# Altium project System 24 UPU.PrjPcb (part 2 of 3)

## Sheet Power.SchDoc
size C; SheetNumber: 2; SheetTotal: 4
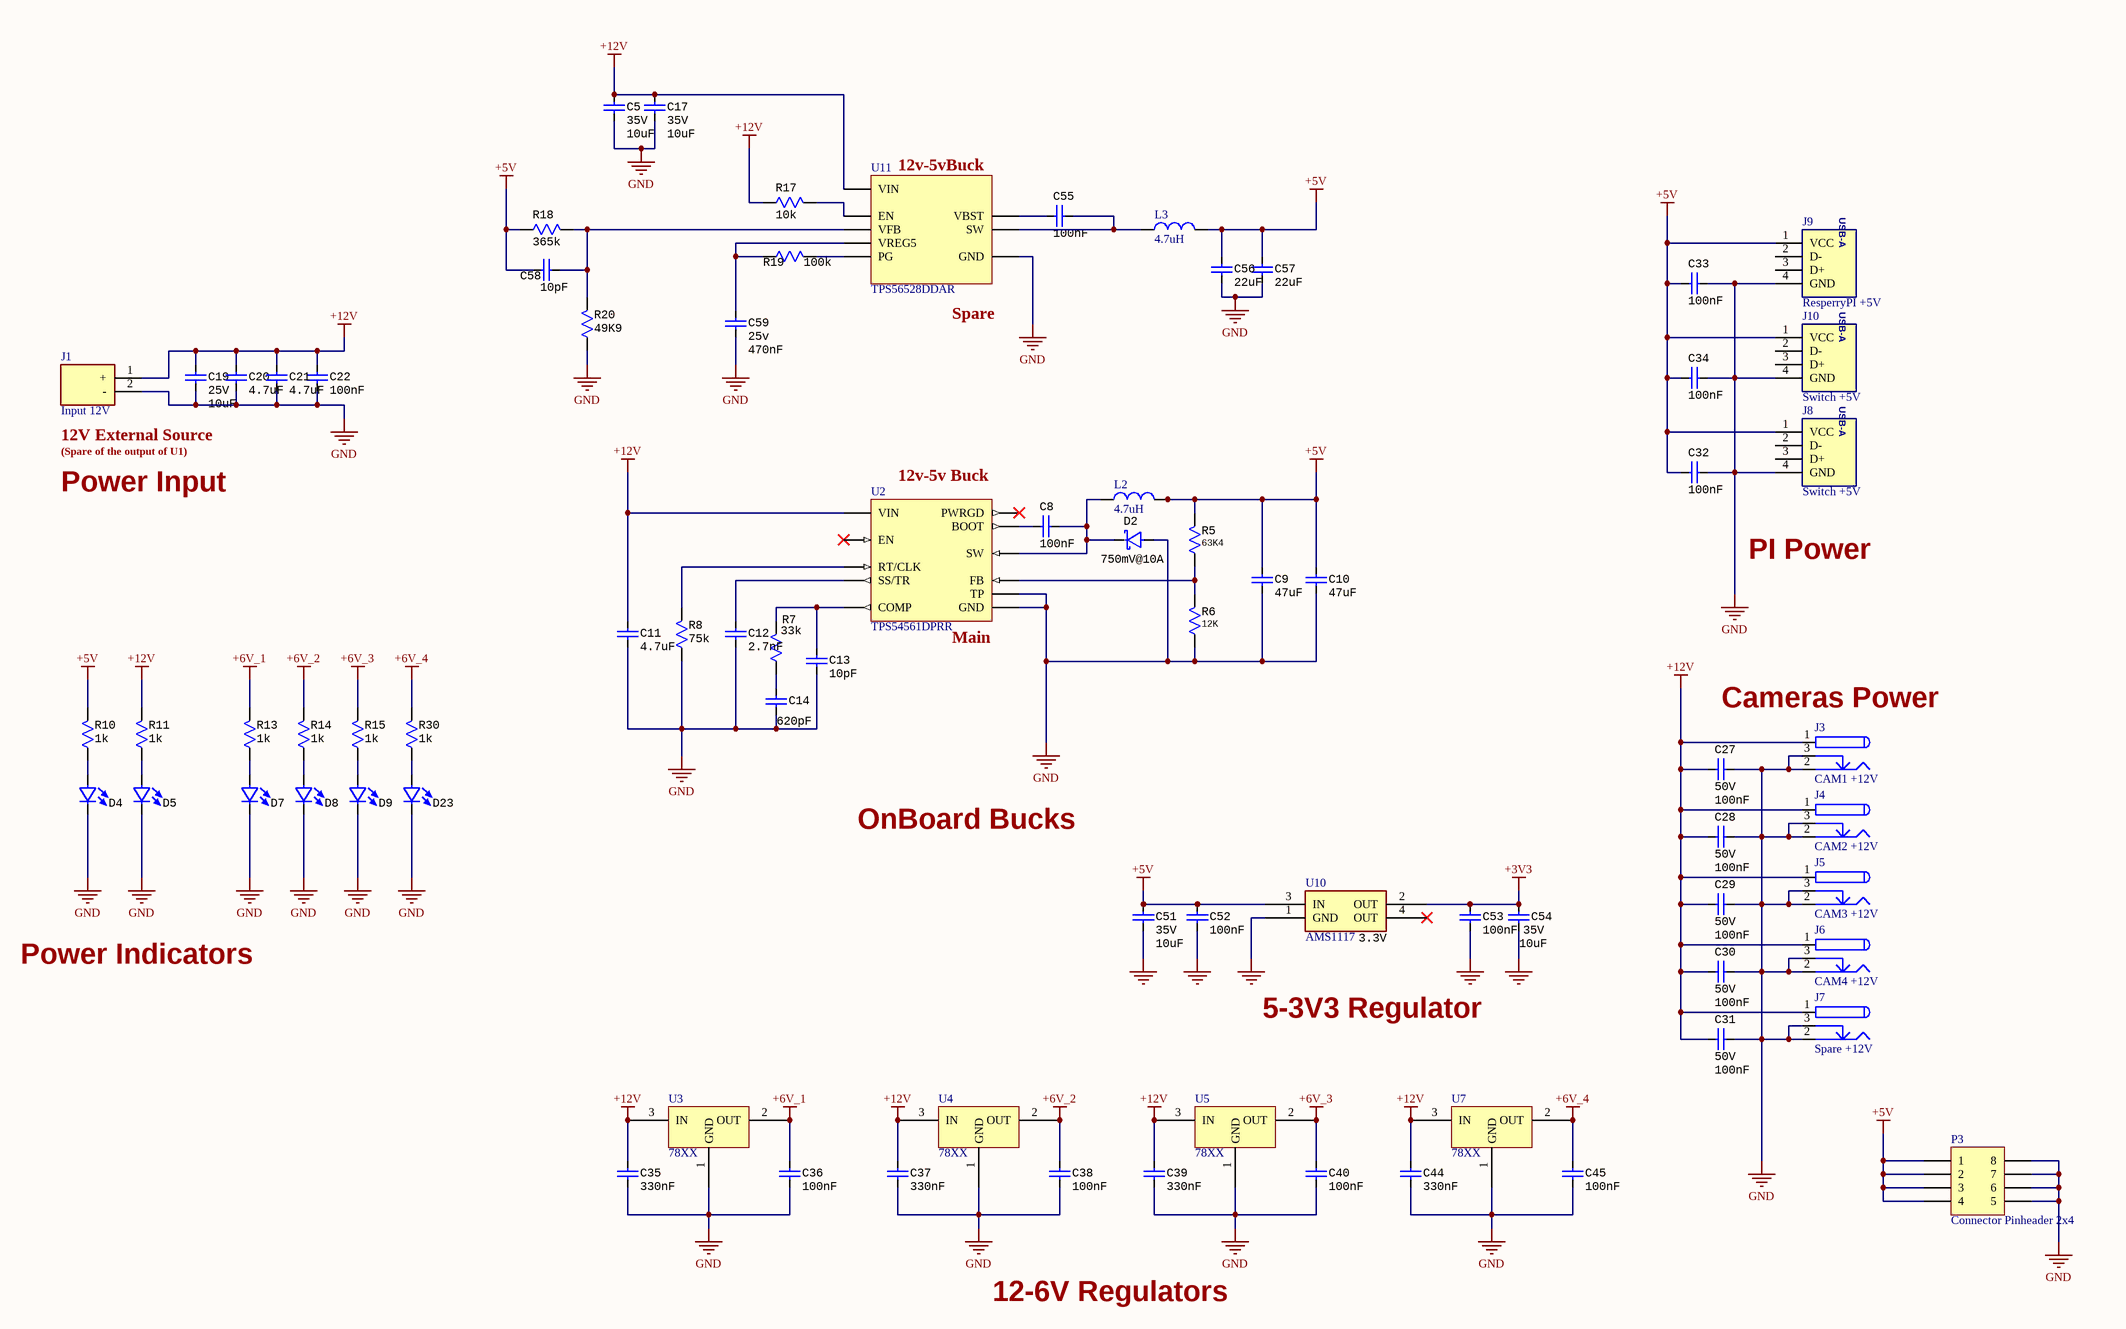
[diagram p1: Power.SchDoc]

### Parts
C5  Voltage: 35V  [CAP Ceramic SMD 0603]  (hidden comment: 10uF)
C8  100nF  [CAP Ceramic SMD 0603]
C9  47uF  [CAP Ceramic SMD 1206]
C10  47uF  [CAP Ceramic SMD 1206]
C11  4.7uF  [CAP Ceramic SMD 1206]
C12  2.7nF  [CAP Ceramic SMD 0603]
C13  10pF  [CAP Ceramic SMD 0603]
C14  620pF  [CAP Ceramic SMD 0603]
C17  Voltage: 35V  [CAP Ceramic SMD 0603]  (hidden comment: 10uF)
C19  Voltage: 25V  [CAP Ceramic SMD 1206]  (hidden comment: 10uF)
C20  4.7uF  [CAP Ceramic SMD 1206]
C21  4.7uF  [CAP Ceramic SMD 1206]
C22  100nF  [CAP Ceramic SMD 0603]
C27  Voltage: 50V  [CAP Ceramic SMD 0603]  (hidden comment: 100nF)
C28  Voltage: 50V  [CAP Ceramic SMD 0603]  (hidden comment: 100nF)
C29  Voltage: 50V  [CAP Ceramic SMD 0603]  (hidden comment: 100nF)
C30  Voltage: 50V  [CAP Ceramic SMD 0603]  (hidden comment: 100nF)
C31  Voltage: 50V  [CAP Ceramic SMD 0603]  (hidden comment: 100nF)
C32  100nF  [CAP Ceramic SMD 0603]
C33  100nF  [CAP Ceramic SMD 0603]
C34  100nF  [CAP Ceramic SMD 0603]
C35  330nF  [CAP Ceramic SMD 0603]
C36  100nF  [CAP Ceramic SMD 0603]
C37  330nF  [CAP Ceramic SMD 0603]
C38  100nF  [CAP Ceramic SMD 0603]
C39  330nF  [CAP Ceramic SMD 0603]
C40  100nF  [CAP Ceramic SMD 0603]
C44  330nF  [CAP Ceramic SMD 0603]
C45  100nF  [CAP Ceramic SMD 0603]
C51  Voltage: 35V  [CAP Ceramic SMD 0603]  (hidden comment: 10uF)
C52  100nF  [CAP Ceramic SMD 0603]
C53  100nF  [CAP Ceramic SMD 0603]
C54  Voltage: 35V  [CAP Ceramic SMD 0603]  (hidden comment: 10uF)
C55  100nF  [CAP Ceramic SMD 0603]
C56  22uF  [CAP Ceramic SMD 0603]
C57  22uF  [CAP Ceramic SMD 0603]
C58  10pF  [CAP Ceramic SMD 0603]
C59  Voltage: 25v  [CAP Ceramic SMD 0603]  (hidden comment: 470nF)
D2  750mV@10A  [TO-277]
D4  (no value)  [LED SMD 0805G]
D5  (no value)  [LED SMD 0805G]
D7  (no value)  [LED SMD 0805G]
D8  (no value)  [LED SMD 0805G]
D9  (no value)  [LED SMD 0805G]
D23  (no value)  [LED SMD 0805G]
J1  Input 12V  [XT60PW-M]
J3  CAM1 +12V  [DC-005]
J4  CAM2 +12V  [DC-005]
J5  CAM3 +12V  [DC-005]
J6  CAM4 +12V  [DC-005]
J7  Spare +12V  [DC-005]
J8  Switch +5V  [USB-A/S_A]
J9  ResperryPI +5V  [USB-A/S_A]
J10  Switch +5V  [USB-A/S_A]
L2  4.7uH  [XLS1040]
L3  4.7uH  [XLS1040]
P3  Connector Pinheader 2x4  [Header 2.54_2X4]
R5  63K4  [RES SMD 0603]
R6  12K  [RES SMD 0603]
R7  33k  [RES SMD 0603]
R8  value 75k  [RES SMD 0603]  (hidden comment: 75kR)
R10  value 1k  [RES SMD 0603]  (hidden comment: 1kR)
R11  value 1k  [RES SMD 0603]  (hidden comment: 1kR)
R13  value 1k  [RES SMD 0603]  (hidden comment: 1kR)
R14  value 1k  [RES SMD 0603]  (hidden comment: 1kR)
R15  value 1k  [RES SMD 0603]  (hidden comment: 1kR)
R17  10k  [RES SMD 0603]
R18  365k  [RES SMD 0603]
R19  100k  [RES SMD 0603]
R20  value 49K9  [RES SMD 0603]  (hidden comment: 49.9kR)
R30  value 1k  [RES SMD 0603]  (hidden comment: 1kR)
U2  TPS54561DPRR  [TPS54561DPRR]
U3  78XX  [Linear reagulator SMD TO252]
U4  78XX  [Linear reagulator SMD TO252]
U5  78XX  [Linear reagulator SMD TO252]
U7  78XX  [Linear reagulator SMD TO252]
U10  AMS1117  Voltage output: 3.3V  [Linear reagulator SMD AMS1117 - duplicate]
U11  TPS56528DDAR  [TPS56528DDAR]

### Nets
+3V3: C53.1 C54.1 U10.2(OUT)
+5V: C9.1 C10.1 C32.2 C33.2 C34.2 C51.1 C52.1 C56.1 C57.1 C58.1 J8.1(VCC) J9.1(VCC) J10.1(VCC) L2.1 L3.1 P3.1 P3.2 P3.3 P3.4 R5.2 R10.2 R18.1 U10.3(IN)
+6V_1: C36.1 R13.2 U3.2(OUT)
+6V_2: C38.1 R14.2 U4.2(OUT)
+6V_3: C40.1 R15.2 U5.2(OUT)
+6V_4: C45.1 R30.2 U7.2(OUT)
+12V: C5.1 C11.1 C17.1 C19.1 C20.1 C21.1 C22.1 C27.1 C28.1 C29.1 C30.1 C31.1 C35.1 C37.1 C39.1 C44.1 J1.1(+) J3.1 J4.1 J5.1 J6.1 J7.1 R11.2 R17.1 U2.2(VIN) U3.3(IN) U4.3(IN) U5.3(IN) U7.3(IN) U11.8(VIN)
GND: C5.2 C9.2 C10.2 C11.2 C12.2 C13.2 C14.2 C17.2 C19.2 C20.2 C21.2 C22.2 C27.2 C28.2 C29.2 C30.2 C31.2 C32.1 C33.1 C34.1 C35.2 C36.2 C37.2 C38.2 C39.2 C40.2 C44.2 C45.2 C51.2 C52.2 C53.2 C54.2 C56.2 C57.2 C59.2 D2.1 D4.2 D5.2 D7.2 D8.2 D9.2 D23.2 J1.2(-) J3.2 J3.3 J4.2 J4.3 J5.2 J5.3 J6.2 J6.3 J7.2 J7.3 J8.4(GND) J9.4(GND) J10.4(GND) P3.5 P3.6 P3.7 P3.8 R6.1 R8.1 R20.1 U2.8(GND) U2.11(TP) U3.1(GND) U4.1(GND) U5.1(GND) U7.1(GND) U10.1(GND) U11.5(GND)
NetC8_1: C8.1 U2.1(BOOT)
NetC8_2: C8.2 D2.2 L2.2 U2.9(SW)
NetC12_1: C12.1 U2.4(SS/TR)
NetC13_1: C13.1 R7.2 U2.7(COMP)
NetC14_1: C14.1 R7.1
NetC55_1: C55.1 U11.7(VBST)
NetC55_2: C55.2 L3.2 U11.6(SW)
NetC58_2: C58.2 R18.2 R20.2 U11.2(VFB)
NetC59_1: C59.1 R19.1 U11.3(VREG5)
NetD4_1: D4.1 R10.1
NetD5_1: D5.1 R11.1
NetD7_1: D7.1 R13.1
NetD8_1: D8.1 R14.1
NetD9_1: D9.1 R15.1
NetD23_1: D23.1 R30.1
NetR5_1: R5.1 R6.2 U2.6(FB)
NetR8_2: R8.2 U2.5(RT/CLK)
NetR17_2: R17.2 U11.1(EN)
NetR19_2: R19.2 U11.4(PG)

Not connected (* = marked no-connect by the designer): J8 2(D-) 3(D+); J9 2(D-) 3(D+); J10 2(D-) 3(D+); U2 3(EN)* 10(PWRGD)*; U10 4(OUT)*

### Notes on the sheet
- (near U11) 12v-5vBuck
- (near U11) Spare
- 12V External Source
- (Spare of the output of U1)
- Power Input
- (near U2) 12v-5v Buck
- PI Power
- (near U2) Main
- (near J3) Cameras Power
- OnBoard Bucks
- Power Indicators
- 5-3V3 Regulator
- 12-6V Regulators
- (in symbol Connector_USB-A) USB-A

### Library data of the parts
C5 C17 C51 C54 = CAP 0603 10uF 35V: Cap Ceramic 10uF 35V X5R 20% Pad SMD 0603 85C T/R; Manufacturer: Murata; Manufacturer Part Number: GRM188R6YA106MA73D; Supplier 1: LCSC; RoHS: Yes; Category: Ceramic Capacitors; Mount: Surface Mount; Case/Package: 0603; Case Code (Metric): 1608; Case Code (Imperial): 0603; Min Operating Temperature: -55°C; Max Operating Temperature: 85°C; Packaging: Tape and Reel; Capacitance: 10uF; Voltage Rating: 35V; Tolerance: 20%; Dielectric: X5R; Voltage Rating (DC): 35V; Length: 0.063inch; Width: 0.031inch; Thickness: 0.039inch; RoHS Compliant: Yes; ComponentLink1URL: http://search.murata.co.jp/Ceramy/image/img/A01X/G101/ENG/GRM188R6YA106MA73-01.pdf?src-supplier=Future+Electronics; ComponentLink1Description: http://search.murata.co.jp/Ceramy/image/img/A01X/G101/ENG/GRM188R6YA106MA73-01.pdf?src-supplier=Future+Electronics; ComponentLink2URL: http://search.murata.co.jp/Ceramy/image/img/A01X/G101/ENG/GRM188R6YA106MA73-01.pdf?src-supplier=Digi-Key; ComponentLink2Description: http://search.murata.co.jp/Ceramy/image/img/A01X/G101/ENG/GRM188R6YA106MA73-01.pdf?src-supplier=Digi-Key; ComponentLink3URL: https://www.murata.com/~/media/webrenewal/support/library/catalog/products/capacitor/mlcc/c02e.ashx?la=en-us&src-supplier=Digi-Key; ComponentLink3Description: https://www.murata.com/~/media/webrenewal/support/library/catalog/products/capacitor/mlcc/c02e.ashx?la=en-us&src-supplier=Digi-Key; ComponentLink4URL: http://search.murata.co.jp/Ceramy/image/img/A01X/G101/ENG/GRM188R6YA106MA73-01.pdf?src-supplier=Mouser; ComponentLink4Description: http://search.murata.co.jp/Ceramy/image/img/A01X/G101/ENG/GRM188R6YA106MA73-01.pdf?src-supplier=Mouser; ComponentLink5URL: http://search.murata.co.jp/Ceramy/image/img/A01X/G101/ENG/GRM188R6YA106MA73-01.pdf?src-supplier=TTI; ComponentLink5Description: http://search.murata.co.jp/Ceramy/image/img/A01X/G101/ENG/GRM188R6YA106MA73-01.pdf?src-supplier=TTI; Supplier Part Number 1: C194427; Value: 10uF
C8 C22 C32-C34 C36 C38 C40 C45 C55 = CAP 0603 100nF 100V: 0603 0.1 uF 100 V ±10% Tolerance X7R Multilayer Ceramic Capacitor; Manufacturer: Yageo; Manufacturer Part Number: CC0603KRX7R0BB104; Voltage Rating: 100V; RoHS: Yes; Category: Ceramic Capacitors; Stock 1: 6927977; Pricing 1: 1=0.17000, 10=0.11900, 50=0.06760, 100=0.05590, 500=0.03922, 1000=0.03246 (USD); Mount: Surface Mount; Case/Package: 0603; Case Code (Metric): 1608; Case Code (Imperial): 0603; Weight: 7.1E-05oz; Min Operating Temperature: -55°C; Max Operating Temperature: 125°C; Package Quantity: 4000; Capacitance: 100nF; Tolerance: 10%; Packaging: Tape and Reel; Dielectric: X7R; Termination: SMD/SMT; Resistor Type: Ceramic; Voltage Rating (DC): 100V; Series: CC; Length: 0.063inch; Width: 0.031inch; Thickness: 0.035inch; Depth: 0.8mm; Lead Free: Lead Free; RoHS Compliant: Yes; ComponentLink1URL: https://datasheet.ciiva.com/6277/mlccorderingcode-6277082.pdf?src-supplier=Digi-Key; ComponentLink1Description: https://datasheet.ciiva.com/6277/mlccorderingcode-6277082.pdf?src-supplier=Digi-Key; ComponentLink2URL: https://datasheet.ciiva.com/6277/mlccorderingcode-6277081.pdf?src-supplier=Digi-Key; ComponentLink2Description: https://datasheet.ciiva.com/6277/mlccorderingcode-6277081.pdf?src-supplier=Digi-Key; ComponentLink3URL: https://datasheet.ciiva.com/6277/mlccorderingcode-6277030.pdf?src-supplier=Digi-Key; ComponentLink3Description: https://datasheet.ciiva.com/6277/mlccorderingcode-6277030.pdf?src-supplier=Digi-Key
  C8 C22 C32-C34: Supplier 1: LCSC; Supplier Part Number 1: C113803
  C36 C38 C40 C45 C55: Supplier: LCSC; Supplier Part Number: C113803
C9 C10 = CAP 1206 47uF 10V: CAP CER 47UF 10V X5R 1206; Manufacturer: Murata; Manufacturer Part Number: GRM31CR61A476ME15L; Tolerance: 20%; Capacitance: 47uF; Supplier 1: LCSC; RoHS: Yes; Category: Ceramic Capacitors; Stock 1: 567615; Pricing 1: 5=0.06560, 50=0.05390, 150=0.04790, 500=0.04290, 2000=0.04120, 4000=0.04000 (USD); Mount: Surface Mount; Case/Package: 1206; Number of Pins: 2; Case Code (Metric): 3216; Case Code (Imperial): 1206; Min Operating Temperature: -55°C; Max Operating Temperature: 85°C; Voltage Rating: 10V; Packaging: Tape and Reel; Package Quantity: 1; Voltage Rating (DC): 10V; Dielectric: X5R; Termination: SMD/SMT; Voltage: 10V; Series: GRM; Construction: Flat; Length: 3.2mm; Width: 1.6mm; Height: 1.6mm; Thickness: 0.071inch; Depth: 1.6mm; Radiation Hardening: No; Reach SVHC Compliant: Yes; Lead Free: Lead Free; RoHS Compliant: Yes; ComponentLink1URL: https://datasheet.ciiva.com/6031/1697710-6031936.pdf?src-supplier=Farnell; ComponentLink1Description: https://datasheet.ciiva.com/6031/1697710-6031936.pdf?src-supplier=Farnell; ComponentLink2URL: https://datasheet.ciiva.com/3779/2151grm31cr61a476me1523-3779480.pdf?src-supplier=Arrow+Electronics; ComponentLink2Description: https://datasheet.ciiva.com/3779/2151grm31cr61a476me1523-3779480.pdf?src-supplier=Arrow+Electronics; ComponentLink3URL: https://datasheet.ciiva.com/14116/grmseries-highdielectrictype-eng-14116399.pdf?src-supplier=Distrelec; ComponentLink3Description: https://datasheet.ciiva.com/14116/grmseries-highdielectrictype-eng-14116399.pdf?src-supplier=Distrelec; ComponentLink4URL: https://datasheet.ciiva.com/7719/1697710-7719146.pdf?src-supplier=Element14; ComponentLink4Description: https://datasheet.ciiva.com/7719/1697710-7719146.pdf?src-supplier=Element14; ComponentLink5URL: https://datasheet.ciiva.com/141/partnumbering-e-01-141780.pdf?src-supplier=Digi-Key; ComponentLink5Description: https://datasheet.ciiva.com/141/partnumbering-e-01-141780.pdf?src-supplier=Digi-Key; ComponentLink6URL: https://datasheet.ciiva.com/141/partnumbering-e-01-141779.pdf?src-supplier=Digi-Key; ComponentLink6Description: https://datasheet.ciiva.com/141/partnumbering-e-01-141779.pdf?src-supplier=Digi-Key; ComponentLink7URL: https://datasheet.ciiva.com/141/partnumbering-e-01-141781.pdf?src-supplier=Digi-Key; ComponentLink7Description: https://datasheet.ciiva.com/141/partnumbering-e-01-141781.pdf?src-supplier=Digi-Key; ComponentLink8URL: https://datasheet.ciiva.com/5416/product-5416711.pdf?src-supplier=Mouser; ComponentLink8Description: https://datasheet.ciiva.com/5416/product-5416711.pdf?src-supplier=Mouser; ComponentLink9URL: https://datasheet.ciiva.com/11606/product-11606488.pdf?src-supplier=Avnet; ComponentLink9Description: https://datasheet.ciiva.com/11606/product-11606488.pdf?src-supplier=Avnet; ComponentLink10URL: https://datasheet.ciiva.com/16461/product-16461242.pdf?src-supplier=Future+Electronics; ComponentLink10Description: https://datasheet.ciiva.com/16461/product-16461242.pdf?src-supplier=Future+Electronics; Supplier Part Number 1: C94034
C11 C20 C21 = CAP 1206 4.7uF 100V: Cap Ceramic 4.7uF 100V X7S 10% SMD 1206 125°C Emboss T/R; Manufacturer Part Number: GRM31CC72A475KE11L; Manufacturer: Murata; Category: Ceramic Capacitors; RoHS Compliant: Yes; Supplier: LCSC; Supplier Part Number: C237304; Capacitance: 4.7uF; Supplier 1: LCSC; Supplier Part Number 1: C237304; RoHS: Yes; Stock 1: 20335; Pricing 1: 5=0.31360, 50=0.26070, 150=0.23810, 500=0.15950, 2000=0.14990, 4000=0.14420 (USD); ComponentLink1URL: https://search.murata.co.jp/Ceramy/image/img/A01X/G101/ENG/GRM31CC72A475KE11-01A.pdf?src-supplier=Digi-Key; ComponentLink1Description: https://search.murata.co.jp/Ceramy/image/img/A01X/G101/ENG/GRM31CC72A475KE11-01A.pdf?src-supplier=Digi-Key
C12 = CAP 0603 2.7nF 50V: 0603 2.7 nF 50 V ±10 % Tolerance X7R SMT Multilayer Ceramic Capacitor; Manufacturer: Yageo; Manufacturer Part Number: CC0603KRX7R9BB272; Tolerance: 10%; Voltage Rating (DC): 50V; Insulation Resistance: 100GR; Supplier 1: LCSC; Supplier Part Number 1: C107085; RoHS: Yes; Category: Ceramic Capacitors; Stock 1: 143654; Pricing 1: 1=0.10000, 10=0.06100, 50=0.03320, 100=0.02710, 500=0.01934, 1000=0.01519 (USD); Mount: Surface Mount; Case/Package: 0603; Case Code (Imperial): 0603; Case Code (Metric): 1608; Dielectric Material: Ceramic; Min Operating Temperature: -55°C; Max Operating Temperature: 125°C; Capacitance: 2.7nF; Dielectric: X7R; Voltage Rating: 50V; Packaging: Tape and Reel; Termination: SMD/SMT; Resistor Type: Ceramic; Voltage: 50V; Series: CC; Construction: Flat; Length: 1.6mm; Width: 0.031inch; Height: 0.8mm; Thickness: 0.035inch; Depth: 0.8mm; Radiation Hardening: No; Lead Free: Lead Free; Halogen Free: Halogen Free; RoHS Compliant: Yes; ComponentLink1URL: https://datasheet.ciiva.com/11786/0900766b80d84f1d-11786435.pdf?src-supplier=RSComponents; ComponentLink1Description: https://datasheet.ciiva.com/11786/0900766b80d84f1d-11786435.pdf?src-supplier=RSComponents; ComponentLink2URL: https://datasheet.ciiva.com/8033/1489800-8033877.pdf?src-supplier=Element14; ComponentLink2Description: https://datasheet.ciiva.com/8033/1489800-8033877.pdf?src-supplier=Element14; ComponentLink3URL: https://datasheet.ciiva.com/13210/upy-gphc-x7r-6-3v-to-50v-8-12304-13210203.pdf?src-supplier=Mouser; ComponentLink3Description: https://datasheet.ciiva.com/13210/upy-gphc-x7r-6-3v-to-50v-8-12304-13210203.pdf?src-supplier=Mouser; ComponentLink4URL: https://datasheet.ciiva.com/11465/upy-gphc-x7r-6-3v-to-50v-8-11465237.pdf?src-supplier=Avnet; ComponentLink4Description: https://datasheet.ciiva.com/11465/upy-gphc-x7r-6-3v-to-50v-8-11465237.pdf?src-supplier=Avnet; ComponentLink5URL: https://datasheet.ciiva.com/26829/getdatasheetpartid-134617-26829446.pdf?src-supplier=Verical; ComponentLink5Description: https://datasheet.ciiva.com/26829/getdatasheetpartid-134617-26829446.pdf?src-supplier=Verical
C13 C58 = CAP 0603 10pF 50V: Surface Mount Ceramic Multilayer Capacitor 10pF 5% C0G 50V 0603 Paper T/R; Manufacturer: Yageo; Manufacturer Part Number: CC0603JRNPO9BN100; Temperature Coefficient: 30ppm/°C; Insulation Resistance: 100GR; Capacitance: 10pF; Supplier Part Number 1: C106245; RoHS: Yes; Category: Ceramic Capacitors; Stock 1: 1278240; Pricing 1: 1=0.10000, 10=0.03600, 50=0.01960, 100=0.01590, 500=0.01138, 1000=0.00894 (USD); Mounting Technology: Surface Mount; Case/Package: 0603; Pins: 2; Case Code (Metric): 1608; Case Code (Imperial): 0603; Min Operating Temperature: -55°C; Max Operating Temperature: 125°C; Tolerance: 5%; Dielectric: C0G; Voltage: 50V; Voltage Rating: 50V; Voltage Rating (DC): 50V; Packaging: Tape and Reel; Package Quantity: 4000; Termination: SMD/SMT; Resistor Type: Ceramic; Series: CC; Length: 1.6mm; Width: 0.8mm; Height: 0.8mm; Thickness: 0.035inch; Depth: 0.8mm; Radiation Hardening: No; RoHS Compliant: Yes; Reach SVHC Compliant: Yes; Lead Free: Lead Free; ComponentLink1URL: https://datasheet.ciiva.com/144/mlccorderingcode-144651.pdf?src-supplier=Digi-Key; ComponentLink1Description: https://datasheet.ciiva.com/144/mlccorderingcode-144651.pdf?src-supplier=Digi-Key; ComponentLink2URL: https://datasheet.ciiva.com/5789/1734582-5789616.pdf?src-supplier=Farnell; ComponentLink2Description: https://datasheet.ciiva.com/5789/1734582-5789616.pdf?src-supplier=Farnell; ComponentLink3URL: https://datasheet.ciiva.com/26862/getdatasheetpartid-403524-26862758.pdf?src-supplier=Verical; ComponentLink3Description: https://datasheet.ciiva.com/26862/getdatasheetpartid-403524-26862758.pdf?src-supplier=Verical; ComponentLink4URL: https://datasheet.ciiva.com/11786/0900766b8079c870-11786407.pdf?src-supplier=Rs; ComponentLink4Description: https://datasheet.ciiva.com/11786/0900766b8079c870-11786407.pdf?src-supplier=Rs; ComponentLink5URL: https://datasheet.ciiva.com/7978/1132289-7978126.pdf?src-supplier=Element14; ComponentLink5Description: https://datasheet.ciiva.com/7978/1132289-7978126.pdf?src-supplier=Element14; ComponentLink6URL: https://datasheet.ciiva.com/46430/1835847-46430150.pdf?src-supplier=Element14; ComponentLink6Description: https://datasheet.ciiva.com/46430/1835847-46430150.pdf?src-supplier=Element14; ComponentLink7URL: https://datasheet.ciiva.com/144/mlccorderingcode-144650.pdf?src-supplier=Digi-Key; ComponentLink7Description: https://datasheet.ciiva.com/144/mlccorderingcode-144650.pdf?src-supplier=Digi-Key; ComponentLink8URL: https://datasheet.ciiva.com/144/mlccorderingcode-144649.pdf?src-supplier=Digi-Key; ComponentLink8Description: https://datasheet.ciiva.com/144/mlccorderingcode-144649.pdf?src-supplier=Digi-Key; ComponentLink9URL: https://datasheet.ciiva.com/5425/upy-gp-np0-16v-to-50v-8-5425564.pdf?src-supplier=Mouser; ComponentLink9Description: https://datasheet.ciiva.com/5425/upy-gp-np0-16v-to-50v-8-5425564.pdf?src-supplier=Mouser; ComponentLink10URL: https://datasheet.ciiva.com/8033/1734582-8033710.pdf?src-supplier=Element14; ComponentLink10Description: https://datasheet.ciiva.com/8033/1734582-8033710.pdf?src-supplier=Element14; ComponentLink11URL: https://datasheet.ciiva.com/8033/1734582-8033706.pdf?src-supplier=Element14; ComponentLink11Description: https://datasheet.ciiva.com/8033/1734582-8033706.pdf?src-supplier=Element14; Supplier 1: LCSC; Value: 10pF
C14 = CAP 0603 620pF 50V: Surface Mount Ceramic Multilayer Capacitor 620pF 5% C0G 50V 0603 Paper T/R; Manufacturer: Yageo; Manufacturer Part Number: CC0603JRNPO9BN621; Supplier 1: LCSC; Supplier Part Number 1: C325470; RoHS: Yes; Category: Ceramic Capacitors; Stock 1: 28329; Pricing 1: 1=0.26000, 10=0.17600, 50=0.10560, 100=0.08920, 500=0.06102, 1000=0.05399 (USD); Mounting Technology: Surface Mount; Case/Package: 0603; Case Code (Imperial): 0603; Case Code (Metric): 1608; Weight: 7.1E-05oz; Min Operating Temperature: -55°C; Max Operating Temperature: 125°C; Value: 620pF; Voltage Rating (DC): 50V; Tolerance: 5%; Packaging: Tape and Reel; Dielectric: C0G; Voltage Rating: 50V; Termination: SMD/SMT; Resistor Type: Ceramic; Series: CC; Length: 0.063inch; Width: 0.031inch; Thickness: 0.035inch; ComponentLink1URL: https://datasheet.ciiva.com/13265/upy-gp-np0-16v-to-50v-8-3714-13265463.pdf?src-supplier=Mouser; ComponentLink1Description: https://datasheet.ciiva.com/13265/upy-gp-np0-16v-to-50v-8-3714-13265463.pdf?src-supplier=Mouser
C19 = CAP 1206 10uF 25V: Ceramic capacitor SMD-1206 10000nF (10uF) /25V X7R# K 10%, Samsung, RoHS/4k/; Manufacturer Part Number: CL31B106KAHNNNE; Dielectric: X7R; ComponentLink10URL: https://datasheet.ciiva.com/25795/cl31b106kahnnne-25795260.pdf?src-supplier=Digi-Key; ComponentLink10Description: https://datasheet.ciiva.com/25795/cl31b106kahnnne-25795260.pdf?src-supplier=Digi-Key; ComponentLink11URL: https://datasheet.ciiva.com/26838/getdatasheetpartid-356415-26838914.pdf?src-supplier=Verical; ComponentLink11Description: https://datasheet.ciiva.com/26838/getdatasheetpartid-356415-26838914.pdf?src-supplier=Verical; ComponentLink12URL: https://datasheet.ciiva.com/16498/cl03a105mq3csnc-16498474.pdf?src-supplier=Future+Electronics; ComponentLink12Description: https://datasheet.ciiva.com/16498/cl03a105mq3csnc-16498474.pdf?src-supplier=Future+Electronics; Supplier 1: LCSC; Manufacturer: Samsung; RoHS: Yes; Category: Ceramic Capacitors; Stock 1: 663420; Pricing 1: 20=0.033200, 200=0.025500, 600=0.022100, 2000=0.019600, 10000=0.018600, 20000=0.017900 (AUD); Mount: Surface Mount; Case/Package: 1206; Case Code (Metric): 3216; Case Code (Imperial): 1206; Min Operating Temperature: -55°C; Max Operating Temperature: 125°C; Tolerance: 10%; Capacitance: 10uF; Packaging: Tape and Reel; Voltage Rating: 25V; Package Quantity: 1; Series: CL; Construction: Flat; Length: 3.2mm; Width: 0.063inch; Height: 1.6mm; Thickness: 0.071inch; Depth: 1.6mm; Radiation Hardening: No; RoHS Compliant: Yes; ComponentLink1URL: https://datasheet.ciiva.com/25795/cl31b106kahnnne-25795260.pdf?src-supplier=Digi-Key; ComponentLink1Description: https://datasheet.ciiva.com/25795/cl31b106kahnnne-25795260.pdf?src-supplier=Digi-Key; ComponentLink2URL: https://datasheet.ciiva.com/26838/getdatasheetpartid-356415-26838914.pdf?src-supplier=Verical; ComponentLink2Description: https://datasheet.ciiva.com/26838/getdatasheetpartid-356415-26838914.pdf?src-supplier=Verical; ComponentLink3URL: https://datasheet.ciiva.com/16498/cl03a105mq3csnc-16498474.pdf?src-supplier=Future+Electronics; ComponentLink3Description: https://datasheet.ciiva.com/16498/cl03a105mq3csnc-16498474.pdf?src-supplier=Future+Electronics; Supplier Part Number 1: C14860; Value: 10uF
C27-C31 = CAP 0603 100nF 50V: Multilayer Ceramic Capacitors MLCC Surface Mount 0603 0.1uF 50 Volts X7R 10%; Manufacturer: Murata; Manufacturer Part Number: GRM188R71H104KA93D; Insulation Resistance: 10GR; Supplier 1: LCSC; RoHS: Yes; Category: Ceramic Capacitors; Stock 1: 3546650; Pricing 1: 50=0.00420, 500=0.00330, 1500=0.00290, 5000=0.00260, 25000=0.00250, 50000=0.00240 (USD); Mount: Surface Mount; Case/Package: 0603; Number of Pins: 2; Case Code (Imperial): 0603; Case Code (Metric): 1608; Dielectric Material: Ceramic; Material: Ceramic; Contact Plating: Tin,Matte; Min Operating Temperature: -55°C; Max Operating Temperature: 125°C; Capacitance: 100nF; Tolerance: 10%; Packaging: Tape and Reel; Dielectric: X7R; Voltage Rating (DC): 50V; Termination: SMD/SMT; Package Quantity: 1; Voltage Rating: 50V; Length: 1.6mm; Width: 0.8mm; Height: 0.8mm; Depth: 0.8mm; Thickness: 0.035inch; Radiation Hardening: No; RoHS Compliant: Yes; REACH SVHC: No SVHC; Lead Free: Lead Free; ComponentLink1URL: https://datasheet.ciiva.com/19467/1857604-19467681.pdf?src-supplier=Jameco; ComponentLink1Description: https://datasheet.ciiva.com/19467/1857604-19467681.pdf?src-supplier=Jameco; ComponentLink2URL: https://datasheet.ciiva.com/11786/0900766b807a1cab-11786047.pdf?src-supplier=RSComponents; ComponentLink2Description: https://datasheet.ciiva.com/11786/0900766b807a1cab-11786047.pdf?src-supplier=RSComponents; ComponentLink3URL: https://datasheet.ciiva.com/29201/451744-da-01-en-vs-kondensator-0603-29201904.pdf?src-supplier=Conrad; ComponentLink3Description: https://datasheet.ciiva.com/29201/451744-da-01-en-vs-kondensator-0603-29201904.pdf?src-supplier=Conrad; ComponentLink4URL: https://datasheet.ciiva.com/7937/4360-7937659.pdf?src-supplier=Element14; ComponentLink4Description: https://datasheet.ciiva.com/7937/4360-7937659.pdf?src-supplier=Element14; ComponentLink5URL: https://datasheet.ciiva.com/14116/nmgrm-data-en-14116602.pdf?src-supplier=Distrelec; ComponentLink5Description: https://datasheet.ciiva.com/14116/nmgrm-data-en-14116602.pdf?src-supplier=Distrelec; ComponentLink6URL: https://datasheet.ciiva.com/48436/nmgrm-data-en-48436667.pdf?src-supplier=Distrelec; ComponentLink6Description: https://datasheet.ciiva.com/48436/nmgrm-data-en-48436667.pdf?src-supplier=Distrelec; ComponentLink7URL: https://datasheet.ciiva.com/28534/4360-28534245.pdf?src-supplier=Element14; ComponentLink7Description: https://datasheet.ciiva.com/28534/4360-28534245.pdf?src-supplier=Element14; ComponentLink8URL: https://datasheet.ciiva.com/131/partnumbering-e-01-131739.pdf?src-supplier=Digi-Key; ComponentLink8Description: https://datasheet.ciiva.com/131/partnumbering-e-01-131739.pdf?src-supplier=Digi-Key; ComponentLink9URL: https://datasheet.ciiva.com/131/partnumbering-e-01-131738.pdf?src-supplier=Digi-Key; ComponentLink9Description: https://datasheet.ciiva.com/131/partnumbering-e-01-131738.pdf?src-supplier=Digi-Key; ComponentLink10URL: https://datasheet.ciiva.com/131/partnumbering-e-01-131740.pdf?src-supplier=Digi-Key; ComponentLink10Description: https://datasheet.ciiva.com/131/partnumbering-e-01-131740.pdf?src-supplier=Digi-Key; ComponentLink11URL: https://datasheet.ciiva.com/7937/1747470-7937658.pdf?src-supplier=Element14; ComponentLink11Description: https://datasheet.ciiva.com/7937/1747470-7937658.pdf?src-supplier=Element14; Supplier Part Number 1: C77055; Value: 100nF
C35 C37 C39 C44 = CAP 0603 330nF 50V: Multilayer Ceramic Capacitor, 0.33 uF, 50 V, ± 10%, X7R, 0603 [1608 Metric]; Manufacturer: TDK; Manufacturer Part Number: C1608X7R1H334K080AC; Voltage Rating: 50V; Supplier 1: LCSC; Supplier Part Number 1: C76621; RoHS: Yes; Category: Ceramic Capacitors; Stock 1: 463113; Pricing 1: 1=0.24000, 10=0.16500, 50=0.11000, 100=0.09350, 500=0.06600, 1000=0.05775 (USD); Mount: Surface Mount; Case/Package: 0603; Case Code (Metric): 1608; Case Code (Imperial): 0603; Weight: 7.1E-05oz; Dielectric Material: Ceramic; Min Operating Temperature: -55°C; Max Operating Temperature: 125°C; Capacitance: 330nF; Tolerance: 10%; Packaging: Tape and Reel; Package Quantity: 1; Voltage Rating (DC): 50V; Dielectric: X7R; Termination: SMD/SMT; Resistor Type: Ceramic; Voltage: 50V; Series: C; Construction: Flat; Length: 1.6mm; Width: 0.031inch; Height: 0.8mm; Thickness: 0.037inch; Depth: 0.8mm; Reach SVHC Compliant: Yes; Lead Free: Lead Free; RoHS Compliant: Yes; ComponentLink1URL: https://datasheet.ciiva.com/22718/1796654-22718021.pdf?src-supplier=Element14; ComponentLink1Description: https://datasheet.ciiva.com/22718/1796654-22718021.pdf?src-supplier=Element14; ComponentLink2URL: https://datasheet.ciiva.com/6290/tdkmlcccaprange-6290791.pdf?src-supplier=Digi-Key; ComponentLink2Description: https://datasheet.ciiva.com/6290/tdkmlcccaprange-6290791.pdf?src-supplier=Digi-Key; ComponentLink3URL: https://datasheet.ciiva.com/16427/general-b11-16427753.pdf?src-supplier=Future+Electronics; ComponentLink3Description: https://datasheet.ciiva.com/16427/general-b11-16427753.pdf?src-supplier=Future+Electronics; ComponentLink4URL: https://datasheet.ciiva.com/23803/1735394-23803004.pdf?src-supplier=Newark; ComponentLink4Description: https://datasheet.ciiva.com/23803/1735394-23803004.pdf?src-supplier=Newark; ComponentLink5URL: https://datasheet.ciiva.com/28451/1796654-28451356.pdf?src-supplier=Element14; ComponentLink5Description: https://datasheet.ciiva.com/28451/1796654-28451356.pdf?src-supplier=Element14; ComponentLink6URL: https://datasheet.ciiva.com/6290/tdkmlcccaprange-6290782.pdf?src-supplier=Digi-Key; ComponentLink6Description: https://datasheet.ciiva.com/6290/tdkmlcccaprange-6290782.pdf?src-supplier=Digi-Key
C52 C53 = CAP 0603 100nF 100V: 0603 0.1 uF 100 V ±10% Tolerance X7R Multilayer Ceramic Capacitor; Manufacturer: Yageo; Manufacturer Part Number: AC0603KRX7R0BB104; Voltage Rating: 100V; Supplier: LCSC; Supplier Part Number: C408909; RoHS: Yes; Category: Ceramic Capacitors; Stock 1: 6927977; Pricing 1: 1=0.17000, 10=0.11900, 50=0.06760, 100=0.05590, 500=0.03922, 1000=0.03246 (USD); Mount: Surface Mount; Case/Package: 0603; Case Code (Metric): 1608; Case Code (Imperial): 0603; Weight: 7.1E-05oz; Min Operating Temperature: -55°C; Max Operating Temperature: 125°C; Package Quantity: 4000; Capacitance: 100nF; Tolerance: 10%; Packaging: Tape and Reel; Dielectric: X7R; Termination: SMD/SMT; Resistor Type: Ceramic; Voltage Rating (DC): 100V; Series: CC; Length: 0.063inch; Width: 0.031inch; Thickness: 0.035inch; Depth: 0.8mm; Lead Free: Lead Free; RoHS Compliant: Yes; ComponentLink1URL: https://datasheet.ciiva.com/6277/mlccorderingcode-6277082.pdf?src-supplier=Digi-Key; ComponentLink1Description: https://datasheet.ciiva.com/6277/mlccorderingcode-6277082.pdf?src-supplier=Digi-Key; ComponentLink2URL: https://datasheet.ciiva.com/6277/mlccorderingcode-6277081.pdf?src-supplier=Digi-Key; ComponentLink2Description: https://datasheet.ciiva.com/6277/mlccorderingcode-6277081.pdf?src-supplier=Digi-Key; ComponentLink3URL: https://datasheet.ciiva.com/6277/mlccorderingcode-6277030.pdf?src-supplier=Digi-Key; ComponentLink3Description: https://datasheet.ciiva.com/6277/mlccorderingcode-6277030.pdf?src-supplier=Digi-Key
C56 C57 = CAP 0603 22uF 16V: 6.3V 22uF X5R ±20% 0603 Multilayer Ceramic Capacitors MLCC - SMD/SMT ROHS; Manufacturer: YAGEO; Manufacturer Part Number: CC0603MRX5R5BB226; Supplier Part Number: C109448; Supplier: LCSC; Mount: Surface Mount; Voltage: 6.3V; Capacitance: 22uF
C59 = CAP 0603 470F 25V: 25V 470nF X7R 0603 Multilayer Ceramic Capacitors MLCC - SMD/SMT ROHS; Manufacturer: Samwha Capacitor; Manufacturer Part Number: CS1608X7R474K250NRB; Supplier Part Number: C2909628; Supplier: LCSC; Value: 470nF
D2 = Schottky 100V 750mV@10A: 100V 750mV@10A 10A TO-277 Schottky Barrier Diodes (SBD) ROHS; Manufacturer: MDD; Manufacturer Part number: SB10100L; Vf@If: 750mV@10A; Supplier: LCSC; Supplier Part Number: C113946
D4 D5 D7-D9 D23 = LED 0805 Emerald: emerald 0805 Light Emitting Diodes (LED) ROHS; Manufacturer: FOSHAN Nationstar Optoelectronics; Manufacturer Part Number: NCD0805G1; Supplier: LCSC; Supplier Part Number: C84260; RoHS: No; Category: Uncategorized; Stock 1: 432460; Pricing 1: 20=0.01910, 200=0.01510, 600=0.01290, 3000=0.01160, 9000=0.01050, 21000=0.00990 (USD)
J1 = XT60PW-M: Power Connectors ROHS; Manufacturer: Changzhou Amass Elec; ManufacturerPartNumber: XT60PW-M; Supplier: LCSC; SupplierPartNumber: C98732
J3-J7 = DC_Socket: CIRCULAR DC POWER CONNECTOR / Rated Current: 7.5A / Rated Volatage: 20VDC
J8-J10 = Connector_USB-A
L2 L3 = IND 0403 4.7uH 20%: 9A 4.7uH ±20% 17mΩ 15A SMD,11.5x10x3.8mm Power Inductors ROHS; Manufacturer: Cjiang; Manufacturer Part Number: FXL1040-4R7-M; Suppleir Part Number: C167230; Supplier: LCSC; ComponentLink1Description: LCSC; ComponentLink1URL: https://www.lcsc.com/product-detail/Power-Inductors_cjiang-Changjiang-Microelectronics-Tech-FXL1040-4R7-M_C167230.html
P3 = Connector Pinheader 2x4: Header_2X4
R5 = RES 0603 63K4 1%: 100mW Thick Film Resistors 75V ±100ppm/℃ ±1% -55℃~+155℃ 63.4kΩ 0603 Chip Resistor - Surface Mount ROHS; Manufacturer: Yageo; Manufacturer Part Number: AC0603FR-0763K4L; Resistance: 63.4kR; Temperature Coefficient: 100ppm/°C; Voltage Rating: 50V; Category: Chip SMD Resistors; Case Code (Imperial): 0603; Case Code (Metric): 1608; Case/Package: 0603; Construction: Rectangular; Depth: 0.8mm; Features: Moisture Resistant,Automotive AEC-Q200; Height: 0.022inch; Lead Free: Lead Free; Length: 0.063inch; Max Operating Temperature: 155°C; Max Power Dissipation: 100mW; Military Standard: Not; Min Operating Temperature: -55°C; Number of Pins: 2; Number of Terminations: 2; Package Quantity: 1; Packaging: Tape and Reel; Power Rating: 100mW; Reach SVHC Compliant: Yes; Resistance Tolerance: 1%; Resistor Type: Thick Film; RoHS Compliant: Yes; Series: RC; Size Code: 0603; Termination: SMD/SMT; Tolerance: 1%; Voltage Rating (DC): 50V; Width: 0.031inch; Supplier: LCSC; Supplier Part Number: C228003
R6 = RES 0603 12K 1%: 100mW Thick Film Resistors 75V ±100ppm/℃ ±1% -55℃~+155℃ 12kΩ 0603 Chip Resistor - Surface Mount ROHS; Manufacturer: Yageo; Manufacturer Part Number: RC0603FR-0712KL; Resistance: 12kR; Temperature Coefficient: 100ppm/°C; Voltage Rating: 50V; Category: Chip SMD Resistors; Case Code (Imperial): 0603; Case Code (Metric): 1608; Case/Package: 0603; Construction: Rectangular; Depth: 0.8mm; Features: Moisture Resistant; Height: 0.022inch; Lead Free: Lead Free; Length: 1.6mm; Max Operating Temperature: 155°C; Max Power Dissipation: 100mW; Military Standard: Not; Min Operating Temperature: -55°C; Number of Pins: 2; Number of Terminations: 2; Package Quantity: 1; Packaging: Tape and Reel; Power Rating: 100mW; Reach SVHC Compliant: Yes; Resistance Tolerance: 1%; Resistor Type: Thick Film; RoHS Compliant: Yes; Series: RC; Size Code: 0603; Termination: SMD/SMT; Tolerance: 1%; Voltage Rating (DC): 50V; Width: 0.8mm; Supplier: LCSC; Supplier Part Number: C114659
R7 = RES 0603 39k 1%: 100mW Thick Film Resistors 75V ±100ppm/℃ ±1% -55℃~+155℃ 39kΩ 0603 Chip Resistor - Surface Mount ROHS; Manufacturer: Uniroyal; Manufacturer Part Number: 0603WAF3902T5E; Supplier 1: LCSC; Supplier Part Number 1: C23153; RoHS: Yes; Stock 1: 490200; Pricing 1: 100=0.00100, 1000=0.00070, 5000=0.00060, 50000=0.00050 (USD); RoHS Compliant: Yes; Resistance: 33k
R8 = RES 0603 75k 1%: Res Thick Film 0603 75K Ohm 1% 0.1W(1/10W) ±100ppm/C Pad SMD Automotive T/R; Manufacturer: Panasonic; Manufacturer Part Number: ERJ3RBD7502V; Tolerance: 0.5%; Temperature Coefficient: 50ppm/°C; Power Rating: 100mW; Voltage Rating: 50V; Supplier 1: LCSC; RoHS: Yes; Category: Chip SMD Resistors; Stock 1: 1820; Pricing 1: 20=0.002200, 200=0.001800, 600=0.001600, 2000=0.001400, 10000=0.001300, 20000=0.001300 (AUD); Mount: Surface Mount; Case/Package: 0603; Case Code (Metric): 1608; Case Code (Imperial): 0603; Min Operating Temperature: -55°C; Max Operating Temperature: 125°C; Packaging: Cut Tape; Resistance: 75kR; Resistor Type: Thick Film; Termination: Solder; Voltage Rating (DC): 50V; Length: 1.6mm; Height: 0.45mm; Depth: 0.8mm; RoHS Compliant: Yes; REACH SVHC: No SVHC; Military Standard: Not; ComponentLink1URL: http://www.farnell.com/datasheets/1911175.pdf?src-supplier=Farnell; ComponentLink1Description: http://www.farnell.com/datasheets/1911175.pdf?src-supplier=Farnell; ComponentLink2URL: https://industrial.panasonic.com/cdbs/www-data/pdf/RDM0000/DMM0000COL11.pdf?src-supplier=Digi-Key; ComponentLink2Description: https://industrial.panasonic.com/cdbs/www-data/pdf/RDM0000/DMM0000COL11.pdf?src-supplier=Digi-Key; ComponentLink3URL: http://www.farnell.com/datasheets/1911175.pdf?src-supplier=Element14; ComponentLink3Description: http://www.farnell.com/datasheets/1911175.pdf?src-supplier=Element14; ComponentLink4URL: http://www.farnell.com/datasheets/1678782.pdf?src-supplier=Element14; ComponentLink4Description: http://www.farnell.com/datasheets/1678782.pdf?src-supplier=Element14; Supplier Part Number 1: C336823; Supplier 2: LCSC; Stock 2: 800; Pricing 2: 50=0.009200, 500=0.007300, 1500=0.006200, 5000=0.005500, 25000=0.005000, 50000=0.004700 (AUD); Contact Plating: Tin; Number of Terminations: 2; Max Power Dissipation: 100mW; Series: ERJ; Package Quantity: 1; Features: Automotive AEC-Q200; Construction: Rectangular; Resistance Tolerance: 1%; Technology: THICK FILM; Width: 0.031inch; Radiation Hardening: No; Lead Free: Lead Free; ComponentLink5URL: https://datasheet.ciiva.com/34303/1988401-34303605.pdf?src-supplier=Jameco; ComponentLink5Description: https://datasheet.ciiva.com/34303/1988401-34303605.pdf?src-supplier=Jameco; ComponentLink6URL: https://datasheet.ciiva.com/46374/426256-46374235.pdf?src-supplier=Element14; ComponentLink6Description: https://datasheet.ciiva.com/46374/426256-46374235.pdf?src-supplier=Element14; ComponentLink7URL: https://datasheet.ciiva.com/28596/1678782-28596232.pdf?src-supplier=Element14; ComponentLink7Description: https://datasheet.ciiva.com/28596/1678782-28596232.pdf?src-supplier=Element14; ComponentLink8URL: https://datasheet.ciiva.com/28676/1678782-28676971.pdf?src-supplier=Element14; ComponentLink8Description: https://datasheet.ciiva.com/28676/1678782-28676971.pdf?src-supplier=Element14; ComponentLink9URL: https://datasheet.ciiva.com/24069/aoa0000ce2-24069064.pdf?src-supplier=Mouser; ComponentLink9Description: https://datasheet.ciiva.com/24069/aoa0000ce2-24069064.pdf?src-supplier=Mouser; ComponentLink10URL: https://datasheet.ciiva.com/9187/aoa0000ce2-9187719.pdf?src-supplier=Avnet; ComponentLink10Description: https://datasheet.ciiva.com/9187/aoa0000ce2-9187719.pdf?src-supplier=Avnet; ComponentLink11URL: https://datasheet.ciiva.com/48531/aoa0000ce2-48531550.pdf?src-supplier=Avnet; ComponentLink11Description: https://datasheet.ciiva.com/48531/aoa0000ce2-48531550.pdf?src-supplier=Avnet; ComponentLink12URL: https://datasheet.ciiva.com/31835/aoa0000ce2-31835674.pdf?src-supplier=Onlinecomponents.com; ComponentLink12Description: https://datasheet.ciiva.com/31835/aoa0000ce2-31835674.pdf?src-supplier=Onlinecomponents.com; ComponentLink13URL: https://datasheet.ciiva.com/15159/getdatasheetpartid-28812-15159210.pdf?src-supplier=Verical; ComponentLink13Description: https://datasheet.ciiva.com/15159/getdatasheetpartid-28812-15159210.pdf?src-supplier=Verical; Supplier Part Number 2: C403347
R10 R11 R13-R15 R30 = RES 0603 1k 1%: Res Thick Film 0603 1K Ohm 1% 1/10W ±100ppm/°C Molded SMD Punched Carrier T/R; Manufacturer: Panasonic; Manufacturer Part Number: ERJ3EKF1001V; Power Rating: 100mW; Voltage Rating: 75V; Supplier 1: LCSC; RoHS: Yes; Category: Chip SMD Resistors; Stock 1: 79650; Pricing 1: 50=0.009600, 500=0.008100, 1500=0.007300, 5000=0.006800, 25000=0.006400, 50000=0.006200 (AUD); Mount: Surface Mount; Case/Package: 0603; Number of Pins: 2; Case Code (Metric): 1608; Case Code (Imperial): 0603; Contact Plating: Tin; Size Code: 0603; Min Operating Temperature: -55°C; Max Operating Temperature: 155°C; Packaging: Tape and Reel; Resistance: 1kR; Resistor Type: Thick Film; Temperature Coefficient: 100ppm/°C; Series: ERJ; Tolerance: 1%; Number of Terminations: 2; Max Power Dissipation: 100mW; Construction: Rectangular; Features: Automotive AEC-Q200; Package Quantity: 5000; Termination: SMD/SMT; Voltage Rating (DC): 75V; Resistance Tolerance: 1%; Technology: THICK FILM; Length: 1.6mm; Width: 0.8mm; Height: 0.45mm; Depth: 0.8mm; Radiation Hardening: No; RoHS Compliant: Yes; Lead Free: Lead Free; Military Standard: Not; REACH SVHC: No SVHC; ComponentLink1URL: https://datasheet.ciiva.com/7942/aoa0000ce2-7942427.pdf?src-supplier=Element14; ComponentLink1Description: https://datasheet.ciiva.com/7942/aoa0000ce2-7942427.pdf?src-supplier=Element14; ComponentLink2URL: https://datasheet.ciiva.com/46373/1678782-46373340.pdf?src-supplier=Element14; ComponentLink2Description: https://datasheet.ciiva.com/46373/1678782-46373340.pdf?src-supplier=Element14; ComponentLink3URL: https://datasheet.ciiva.com/22673/1678782-22673918.pdf?src-supplier=Element14; ComponentLink3Description: https://datasheet.ciiva.com/22673/1678782-22673918.pdf?src-supplier=Element14; ComponentLink4URL: https://datasheet.ciiva.com/46373/1678782-46373339.pdf?src-supplier=Element14; ComponentLink4Description: https://datasheet.ciiva.com/46373/1678782-46373339.pdf?src-supplier=Element14; ComponentLink5URL: https://datasheet.ciiva.com/24070/aoa0000ce2-24070269.pdf?src-supplier=Mouser; ComponentLink5Description: https://datasheet.ciiva.com/24070/aoa0000ce2-24070269.pdf?src-supplier=Mouser; ComponentLink6URL: https://datasheet.ciiva.com/16768/70260748-16768437.pdf?src-supplier=Allied+Electronics; ComponentLink6Description: https://datasheet.ciiva.com/16768/70260748-16768437.pdf?src-supplier=Allied+Electronics; ComponentLink7URL: https://datasheet.ciiva.com/16774/70260748-16774550.pdf?src-supplier=Allied+Electronics; ComponentLink7Description: https://datasheet.ciiva.com/16774/70260748-16774550.pdf?src-supplier=Allied+Electronics; ComponentLink8URL: https://datasheet.ciiva.com/9198/aoa0000ce2-9198923.pdf?src-supplier=Avnet; ComponentLink8Description: https://datasheet.ciiva.com/9198/aoa0000ce2-9198923.pdf?src-supplier=Avnet; ComponentLink9URL: https://datasheet.ciiva.com/16449/aoa0000ce2-16449065.pdf?src-supplier=Future+Electronics; ComponentLink9Description: https://datasheet.ciiva.com/16449/aoa0000ce2-16449065.pdf?src-supplier=Future+Electronics; ComponentLink10URL: https://datasheet.ciiva.com/48530/aoa0000ce2-48530987.pdf?src-supplier=Avnet; ComponentLink10Description: https://datasheet.ciiva.com/48530/aoa0000ce2-48530987.pdf?src-supplier=Avnet; ComponentLink11URL: https://datasheet.ciiva.com/30063/aoa0000ce2-30063390.pdf?src-supplier=Onlinecomponents.com; ComponentLink11Description: https://datasheet.ciiva.com/30063/aoa0000ce2-30063390.pdf?src-supplier=Onlinecomponents.com; Supplier Part Number 1: C118155
R17 = RES 0603 10k 1%: Res Thick Film 0603 10K Ohm 1% 1/10W ±100ppm/°C Molded SMD Punched Carrier T/R; Manufacturer: Panasonic; Manufacturer Part Number: ERJ3EKF1002V; Resistance: 10kR; Max Power Dissipation: 100mW; Voltage Rating: 75V; Supplier: LCSC; RoHS: Yes; Category: Chip SMD Resistors; Stock: 555600; Pricing: 50=0.010200, 500=0.008400, 1500=0.007300, 5000=0.006100, 25000=0.005500, 50000=0.005400 (AUD); Mount: Surface Mount; Case/Package: 0603; Number of Pins: 2; Case Code (Metric): 1608; Case Code (Imperial): 0603; Contact Plating: Tin; Size Code: 0603; Min Operating Temperature: -55°C; Max Operating Temperature: 155°C; Packaging: Tape and Reel; Resistor Type: Thick Film; Temperature Coefficient: 100ppm/°C; Tolerance: 1%; Number of Terminations: 2; Series: ERJ; Construction: Rectangular; Power Rating: 100mW; Features: Automotive AEC-Q200; Voltage Rating (DC): 75V; Package Quantity: 1; Resistance Tolerance: 1%; Termination: SMD/SMT; Technology: THICK FILM; Length: 1.6mm; Width: 0.031inch; Height: 0.45mm; Depth: 0.8mm; Radiation Hardening: No; RoHS Compliant: Yes; Military Standard: Not; Lead Free: Lead Free; REACH SVHC: No SVHC; ComponentLink1URL: https://datasheet.ciiva.com/7830/aoa0000ce2-7830729.pdf?src-supplier=Element14; ComponentLink1Description: https://datasheet.ciiva.com/7830/aoa0000ce2-7830729.pdf?src-supplier=Element14; ComponentLink2URL: https://datasheet.ciiva.com/46372/1678782-46372725.pdf?src-supplier=Element14; ComponentLink2Description: https://datasheet.ciiva.com/46372/1678782-46372725.pdf?src-supplier=Element14; ComponentLink3URL: https://datasheet.ciiva.com/28514/426256-28514198.pdf?src-supplier=Element14; ComponentLink3Description: https://datasheet.ciiva.com/28514/426256-28514198.pdf?src-supplier=Element14; ComponentLink4URL: https://datasheet.ciiva.com/24070/aoa0000ce2-24070318.pdf?src-supplier=Mouser; ComponentLink4Description: https://datasheet.ciiva.com/24070/aoa0000ce2-24070318.pdf?src-supplier=Mouser; ComponentLink5URL: https://datasheet.ciiva.com/16759/70260748-16759807.pdf?src-supplier=Allied+Electronics; ComponentLink5Description: https://datasheet.ciiva.com/16759/70260748-16759807.pdf?src-supplier=Allied+Electronics; ComponentLink6URL: https://datasheet.ciiva.com/9194/aoa0000ce2-9194199.pdf?src-supplier=Avnet; ComponentLink6Description: https://datasheet.ciiva.com/9194/aoa0000ce2-9194199.pdf?src-supplier=Avnet; ComponentLink7URL: https://datasheet.ciiva.com/48530/aoa0000ce2-48530988.pdf?src-supplier=Avnet; ComponentLink7Description: https://datasheet.ciiva.com/48530/aoa0000ce2-48530988.pdf?src-supplier=Avnet; ComponentLink8URL: https://datasheet.ciiva.com/30208/aoa0000ce2-30208985.pdf?src-supplier=Onlinecomponents.com; ComponentLink8Description: https://datasheet.ciiva.com/30208/aoa0000ce2-30208985.pdf?src-supplier=Onlinecomponents.com; Supplier Part Number: C191124; Value: 10k
R18 = RES 0603 365k 0.1%: 100mW Thin Film Resistor ±25ppm/℃ ±0.1% 365kΩ 0603 Chip Resistor - Surface Mount ROHS; Manufacturer: YAGEO; Manufacturer Part Number: RT0603BRD07365KL; Supplier: LCSC; Supplier Part Number: C861349; Value: 365k
R19 = RES 0603 100k 1%: RES SMD 100K OHM 1% 1/10W 0603; Manufacturer: Panasonic; Manufacturer Part Number: ERJ3EKF1003V; Temperature Coefficient: 100ppm/°C; Power Rating: 100mW; Voltage Rating: 75V; RoHS: Yes; Category: Chip SMD Resistors; Stock: 373100; Pricing: 50=0.00790, 500=0.00640, 1500=0.00550, 5000=0.00500, 25000=0.00460, 50000=0.00430 (USD); Mount: Surface Mount; Case/Package: 0603; Number of Pins: 2; Case Code (Imperial): 0603; Case Code (Metric): 1608; Contact Plating: Tin; Weight: 7.1E-05oz; Size Code: 0603; Min Operating Temperature: -55°C; Max Operating Temperature: 155°C; Tolerance: 1%; Packaging: Tape and Reel; Resistor Type: Thick Film; Series: ERJ; Termination: SMD/SMT; Number of Terminations: 2; Max Power Dissipation: 100mW; Features: Automotive AEC-Q200; Construction: Rectangular; Package Quantity: 5000; Resistance Tolerance: 1%; Voltage Rating (DC): 75V; Length: 1.6mm; Width: 0.8mm; Height: 0.022inch; Depth: 0.8mm; Radiation Hardening: No; RoHS Compliant: Yes; Military Standard: Not; REACH SVHC: No SVHC; Lead Free: Lead Free; ComponentLink1URL: https://datasheet.ciiva.com/34303/1987476-34303566.pdf?src-supplier=Jameco; ComponentLink1Description: https://datasheet.ciiva.com/34303/1987476-34303566.pdf?src-supplier=Jameco; ComponentLink2URL: https://datasheet.ciiva.com/16770/70260748-16770253.pdf?src-supplier=Allied+Electronics; ComponentLink2Description: https://datasheet.ciiva.com/16770/70260748-16770253.pdf?src-supplier=Allied+Electronics; ComponentLink3URL: https://datasheet.ciiva.com/16740/aoa0000ce2-16740662.pdf?src-supplier=Future+Electronics; ComponentLink3Description: https://datasheet.ciiva.com/16740/aoa0000ce2-16740662.pdf?src-supplier=Future+Electronics; ComponentLink4URL: https://datasheet.ciiva.com/15158/getdatasheetpartid-247527-15158907.pdf?src-supplier=Verical; ComponentLink4Description: https://datasheet.ciiva.com/15158/getdatasheetpartid-247527-15158907.pdf?src-supplier=Verical; ComponentLink5URL: https://datasheet.ciiva.com/30133/aoa0000ce2-30133845.pdf?src-supplier=Onlinecomponents.com; ComponentLink5Description: https://datasheet.ciiva.com/30133/aoa0000ce2-30133845.pdf?src-supplier=Onlinecomponents.com; Supplier Part Number: C189597; Supplier: LCSC; Resistance: 100k
R20 = RES 0603 49K9 1%: 100mW Thick Film Resistors 75V ±100ppm/℃ ±1% -55℃~+155℃ 49.9kΩ 0603 Chip Resistor - Surface Mount ROHS; Manufacturer: Yageo Phycomp; Manufacturer Part Number: RC0603FR-0749K9L; Temperature Coefficient: 100ppm/°C; Voltage Rating (DC): 50V; Supplier 1: LCSC; RoHS: Yes; Category: Uncategorized; Stock 1: 31800; Pricing 1: 50=0.004700, 500=0.003800, 1500=0.003200, 5000=0.002900, 25000=0.002600, 50000=0.002500 (AUD); Mount: Surface Mount; Case/Package: 0603; Case Code (Metric): 1608; Case Code (Imperial): 0603; Contact Plating: Tin; Min Operating Temperature: -55°C; Max Operating Temperature: 155°C; Packaging: Cut Tape; Resistance: 49.9kR; Tolerance: 1%; Number of Terminations: 2; Max Power Dissipation: 100mW; Resistor Type: Thick Film; Series: RC; Power Rating: 100mW; Features: Moisture Resistant; Package Quantity: 1; Voltage Rating: 75V; Termination: SMD/SMT; Construction: Rectangular; Resistance Tolerance: 1%; Technology: THICK FILM; Length: 1.6mm; Width: 800um; Height: 0.45mm; Depth: 0.8mm; Radiation Hardening: No; RoHS Compliant: Yes; Lead Free: Lead Free; Military Standard: Not; REACH SVHC: No SVHC; ComponentLink1URL: https://datasheet.ciiva.com/27055/1988381-27055702.pdf?src-supplier=Jameco; ComponentLink1Description: https://datasheet.ciiva.com/27055/1988381-27055702.pdf?src-supplier=Jameco; ComponentLink2URL: https://datasheet.ciiva.com/46386/426256-46386762.pdf?src-supplier=Element14; ComponentLink2Description: https://datasheet.ciiva.com/46386/426256-46386762.pdf?src-supplier=Element14; ComponentLink3URL: https://datasheet.ciiva.com/5868/426256-5868143.pdf?src-supplier=Farnell; ComponentLink3Description: https://datasheet.ciiva.com/5868/426256-5868143.pdf?src-supplier=Farnell; ComponentLink4URL: https://datasheet.ciiva.com/46374/426256-46374007.pdf?src-supplier=Element14; ComponentLink4Description: https://datasheet.ciiva.com/46374/426256-46374007.pdf?src-supplier=Element14; ComponentLink5URL: https://datasheet.ciiva.com/24026/aoa0000ce2-24026079.pdf?src-supplier=Mouser; ComponentLink5Description: https://datasheet.ciiva.com/24026/aoa0000ce2-24026079.pdf?src-supplier=Mouser; ComponentLink6URL: https://datasheet.ciiva.com/16779/70260748-16779334.pdf?src-supplier=Allied+Electronics; ComponentLink6Description: https://datasheet.ciiva.com/16779/70260748-16779334.pdf?src-supplier=Allied+Electronics; ComponentLink7URL: https://datasheet.ciiva.com/16765/70260748-16765239.pdf?src-supplier=Allied+Electronics; ComponentLink7Description: https://datasheet.ciiva.com/16765/70260748-16765239.pdf?src-supplier=Allied+Electronics; ComponentLink8URL: https://datasheet.ciiva.com/30163/aoa0000ce2-30163966.pdf?src-supplier=Onlinecomponents.com; ComponentLink8Description: https://datasheet.ciiva.com/30163/aoa0000ce2-30163966.pdf?src-supplier=Onlinecomponents.com; Supplier Part Number 1: C403346; Size Code: 0603; Weight: 7.1E-05oz
U2 = TPS54561DPRR: 4.5V to 60V Input 5A Step-Down DC-DC Converter With Soft-Start and Eco-mode 10-WSON -40 to 125; Manufacturer: Texas Instruments; Max Output Voltage: 59V; Min Output Voltage: 800mV; Number of Outputs: 1; Output Configuration: Positive; Output Type: Adjustable; Quiescent Current: 152uA; Switching Frequency: 2.5MHz; Synchronous Rectifier: No; Category: Voltage Regulators - Switching; Lead Free: Lead Free; Manufacturer Part Number: TPS54561DPRR; Max Input Voltage: 60V; Max Operating Temperature: 125°C; Max Output Current: 5A; Min Input Voltage: 4.5V; Min Operating Temperature: -40°C; Mount: Surface Mount; Number of Pins: 10; Operating Supply Voltage: 60V; Output Current: 5A; Output Voltage: 59V; Package Quantity: 3000; Packaging: Tape and Reel; Radiation Hardening: No; RoHS Compliant: Yes
U10 = AMS1117: Manufacturer: Advanced Monolithic Systems; Voltage max: 15V; Current max: 10mA; Operating temperature: 0°C ~ 125°C; HelpURL: https://forum.digikey.com/t/cross-reference-for-ams1117-3-3/4397
U11 = TPS56528DDAR: Step-down type Adjustable 600mV~7V 5A 4.5V~18V SOIC-8-EP DC-DC Converters ROHS; Manufacturer: Texas Instruments; Manufacturer Part Number: TPS56528DDAR; Supplier Part Number: C138716; Supplier: LSCS